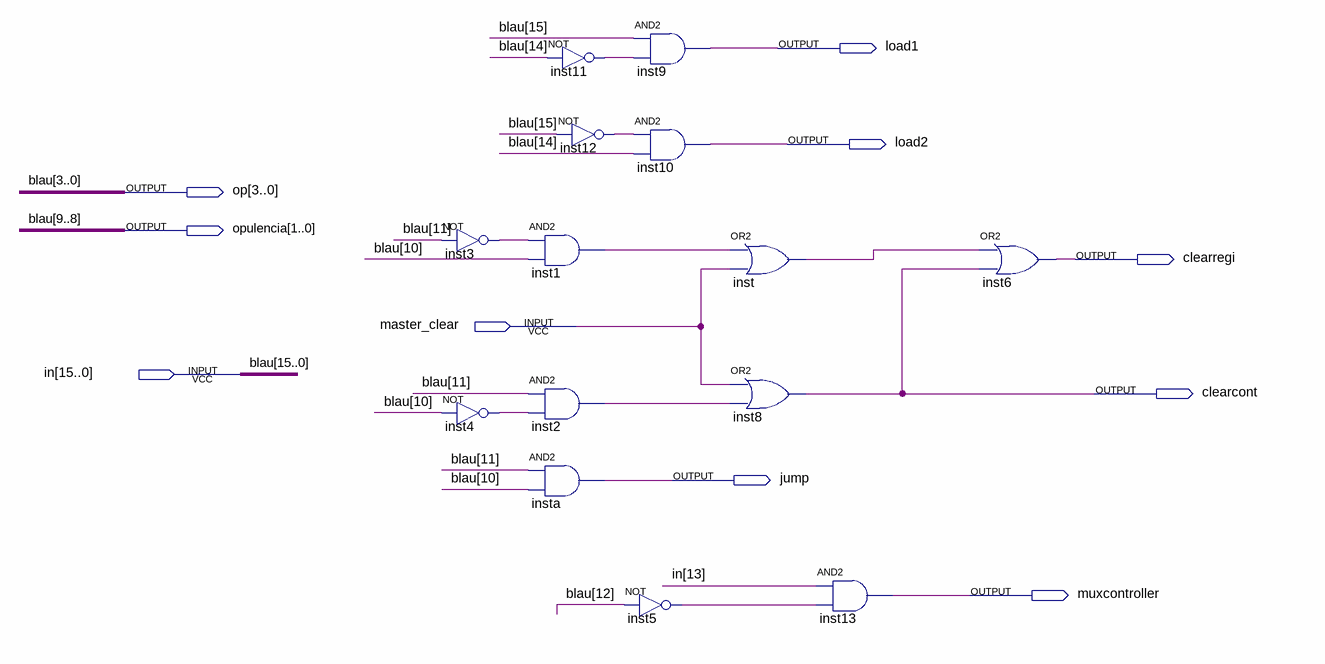
[diagram p0: schematic sheet]
// Quartus schematic UC.bdf as structural Verilog: 14 symbols, 10 pins
module UC (
  input  master_clear,
  input  [15:0] in,
  output load1,
  output load2,
  output [3:0] op,
  output [1:0] opulencia,
  output clearregi,
  output clearcont,
  output jump,
  output muxcontroller
);

  wire inst1_out, inst2_out, inst3_out, inst4_out, inst5_out, inst11_out, inst12_out, inst_out;

  not inst3 (inst3_out, in[11]);
  not inst4 (inst4_out, in[10]);
  not inst11 (inst11_out, in[14]);
  not inst12 (inst12_out, in[15]);
  and inst1 (inst1_out, inst3_out, in[10]);
  and inst2 (inst2_out, in[11], inst4_out);
  and insta (jump, in[11], in[10]);
  and inst9 (load1, in[15], inst11_out);
  and inst10 (load2, inst12_out, in[14]);
  not inst5 (inst5_out, in[12]);
  or inst (inst_out, inst1_out, master_clear);
  or inst8 (clearcont, master_clear, inst2_out);
  and inst13 (muxcontroller, in[13], inst5_out);
  or inst6 (clearregi, inst_out, clearcont);

  assign op = in[3:0];
  assign opulencia = in[9:8];

  // Other names for the same wires on the sheet: blau[15:0] = in
endmodule
